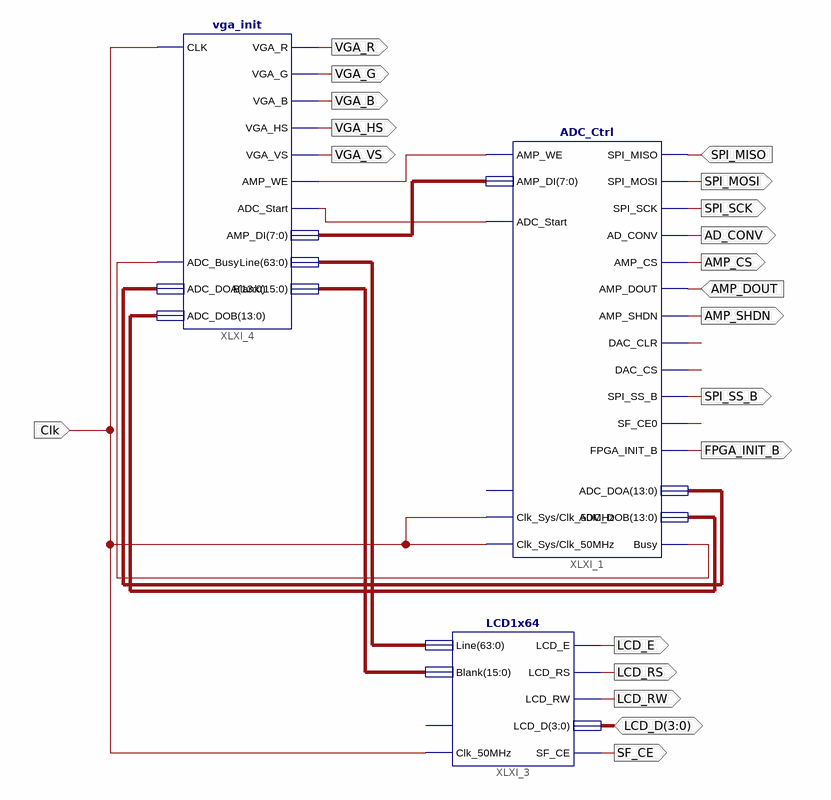
[diagram p0: schematic sheet 1]
// Xilinx ISE schematic schema1.sch (spartan3e) as structural Verilog: 3 symbols, 20 ports
module schema1 (
  input  Clk,
  input  SPI_MISO,
  input  AMP_DOUT,
  inout  [3:0] LCD_D,
  output VGA_R,
  output VGA_G,
  output VGA_B,
  output VGA_HS,
  output VGA_VS,
  output SPI_MOSI,
  output SPI_SCK,
  output AD_CONV,
  output AMP_CS,
  output AMP_SHDN,
  output SPI_SS_B,
  output FPGA_INIT_B,
  output LCD_E,
  output LCD_RS,
  output LCD_RW,
  output SF_CE
);

  wire XLXN_7, XLXN_8, XLXN_21, XLXN_29, XLXN_30, XLXN_32;
  wire [7:0] XLXN_9;
  wire [13:0] XLXN_18, XLXN_19;
  wire [15:0] XLXN_11;
  wire [63:0] XLXN_10;

  ADC_Ctrl XLXI_1 (
    .Clk_Sys(Clk), .AMP_WE(XLXN_7), .ADC_Start(XLXN_8), .SPI_MISO(SPI_MISO), .AMP_DOUT(AMP_DOUT),
    .AMP_DI(XLXN_9), .Busy(XLXN_21), .SPI_MOSI(SPI_MOSI), .SPI_SCK(SPI_SCK), .AMP_CS(AMP_CS),
    .AMP_SHDN(AMP_SHDN), .AD_CONV(AD_CONV), .DAC_CS(XLXN_30), .DAC_CLR(XLXN_29), .SPI_SS_B(SPI_SS_B),
    .SF_CE0(XLXN_32), .FPGA_INIT_B(FPGA_INIT_B), .ADC_DOA(XLXN_18), .ADC_DOB(XLXN_19), .Clk_50MHz(Clk));  // open: Reset
  LCD1x64 XLXI_3 (
    .Clk_50MHz(Clk), .Line(XLXN_10), .Blank(XLXN_11), .LCD_D(LCD_D), .LCD_E(LCD_E), .LCD_RW(LCD_RW),
    .LCD_RS(LCD_RS), .SF_CE(SF_CE));  // open: Reset
  vga_init XLXI_4 (
    .CLK(Clk), .ADC_Busy(XLXN_21), .ADC_DOA(XLXN_18), .ADC_DOB(XLXN_19), .VGA_R(VGA_R), .VGA_G(VGA_G),
    .VGA_B(VGA_B), .VGA_HS(VGA_HS), .VGA_VS(VGA_VS), .AMP_WE(XLXN_7), .ADC_Start(XLXN_8), .AMP_DI(XLXN_9),
    .Line(XLXN_10), .Blank(XLXN_11));
endmodule
